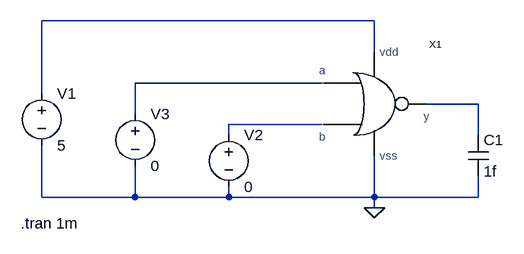
[diagram p0: schematic testbench-nor.asc]
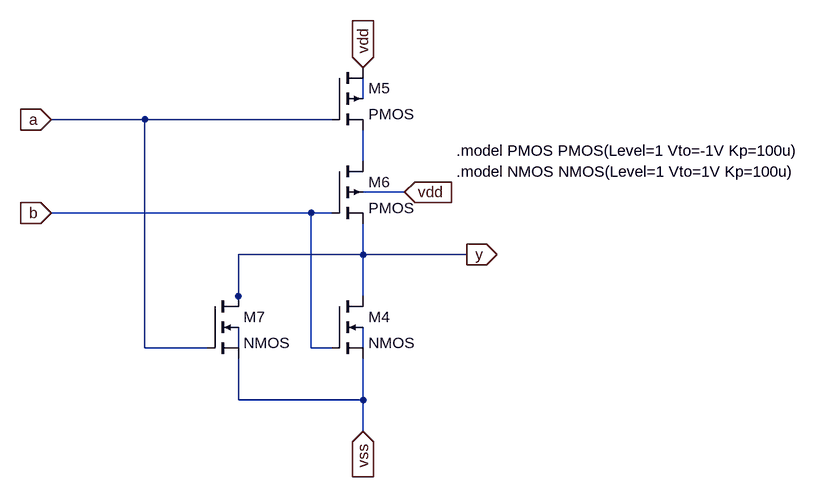
[diagram p1: sub-circuit nor.asc]
testbench-nor.asc, the LTspice schematic file:
Version 4
SHEET 1 880 680
WIRE 0 32 -512 32
WIRE 0 80 0 32
WIRE -80 128 -368 128
WIRE -512 144 -512 32
WIRE 160 160 80 160
WIRE -368 176 -368 128
WIRE -80 192 -224 192
WIRE -224 208 -224 192
WIRE 160 208 160 160
WIRE -512 304 -512 224
WIRE -368 304 -368 256
WIRE -368 304 -512 304
WIRE -224 304 -224 288
WIRE -224 304 -368 304
WIRE 0 304 0 240
WIRE 0 304 -224 304
WIRE 160 304 160 272
WIRE 160 304 0 304
WIRE 0 320 0 304
FLAG 0 320 0
SYMBOL voltage -512 128 R0
WINDOW 123 0 0 Left 0
WINDOW 39 0 0 Left 0
SYMATTR InstName V1
SYMATTR Value 5
SYMBOL voltage -224 192 R0
WINDOW 123 0 0 Left 0
WINDOW 39 0 0 Left 0
SYMATTR InstName V2
SYMATTR Value 0
SYMBOL cap 144 208 R0
SYMATTR InstName C1
SYMATTR Value 1f
SYMBOL voltage -368 160 R0
WINDOW 123 0 0 Left 0
WINDOW 39 0 0 Left 0
SYMATTR InstName V3
SYMATTR Value 0
SYMBOL nor 0 160 R0
SYMATTR InstName X1
TEXT -544 344 Left 2 !.tran 1m

nor.asc, the sub-circuit schematic file:
Version 4
SHEET 1 2116 680
WIRE 1408 0 1408 -32
WIRE 1072 32 928 32
WIRE 1360 32 1072 32
WIRE 1408 96 1408 48
WIRE 1472 144 1408 144
WIRE 1328 176 928 176
WIRE 1360 176 1328 176
WIRE 1408 240 1408 192
WIRE 1408 240 1216 240
WIRE 1568 240 1408 240
WIRE 1216 304 1216 240
WIRE 1408 304 1408 240
WIRE 1216 320 1216 304
WIRE 1072 384 1072 32
WIRE 1168 384 1072 384
WIRE 1216 384 1216 352
WIRE 1328 384 1328 176
WIRE 1360 384 1328 384
WIRE 1408 384 1408 352
WIRE 1216 464 1216 400
WIRE 1408 464 1408 400
WIRE 1408 464 1216 464
WIRE 1408 512 1408 464
FLAG 928 32 a
IOPIN 928 32 In
FLAG 1408 -48 vdd
IOPIN 1408 -48 In
FLAG 1568 240 y
IOPIN 1568 240 Out
FLAG 1408 512 vss
IOPIN 1408 512 In
FLAG 928 176 b
IOPIN 928 176 In
FLAG 1472 144 vdd
IOPIN 1472 144 In
SYMBOL nmos4 1360 304 R0
SYMATTR InstName M4
SYMATTR Value2 l=1u w=1u
SYMBOL pmos4 1360 -48 R0
SYMATTR InstName M5
SYMATTR Value2 l=1u w=1u
SYMBOL pmos4 1360 96 R0
SYMATTR InstName M6
SYMATTR Value2 l=1u w=1u
SYMBOL nmos4 1168 304 R0
SYMATTR InstName M7
SYMATTR Value2 l=1u w=1u
TEXT 1552 80 Left 2 !.model PMOS PMOS(Level=1 Vto=-1V Kp=100u)
TEXT 1552 112 Left 2 !.model NMOS NMOS(Level=1 Vto=1V Kp=100u)

The netlist it stands for:
* testbench-nor.asc
V1 N001 0 5
V2 N004 0 0
C1 N003 0 1f
V3 N002 0 0
XX1 N002 N004 N003 N001 0 nor

* block symbol definitions
.subckt nor a b y vdd vss
M4 y b vss N004 NMOS l=1u w=1u
M5 vdd a N002 N001 PMOS l=1u w=1u
M6 N002 b y vdd PMOS l=1u w=1u
M7 y a vss N003 NMOS l=1u w=1u
.model PMOS PMOS(Level=1 Vto=-1V Kp=100u)
.model NMOS NMOS(Level=1 Vto=1V Kp=100u)
.ends nor

.model NMOS NMOS
.model PMOS PMOS
.lib standard.mos
.tran 1m
.backanno
.end